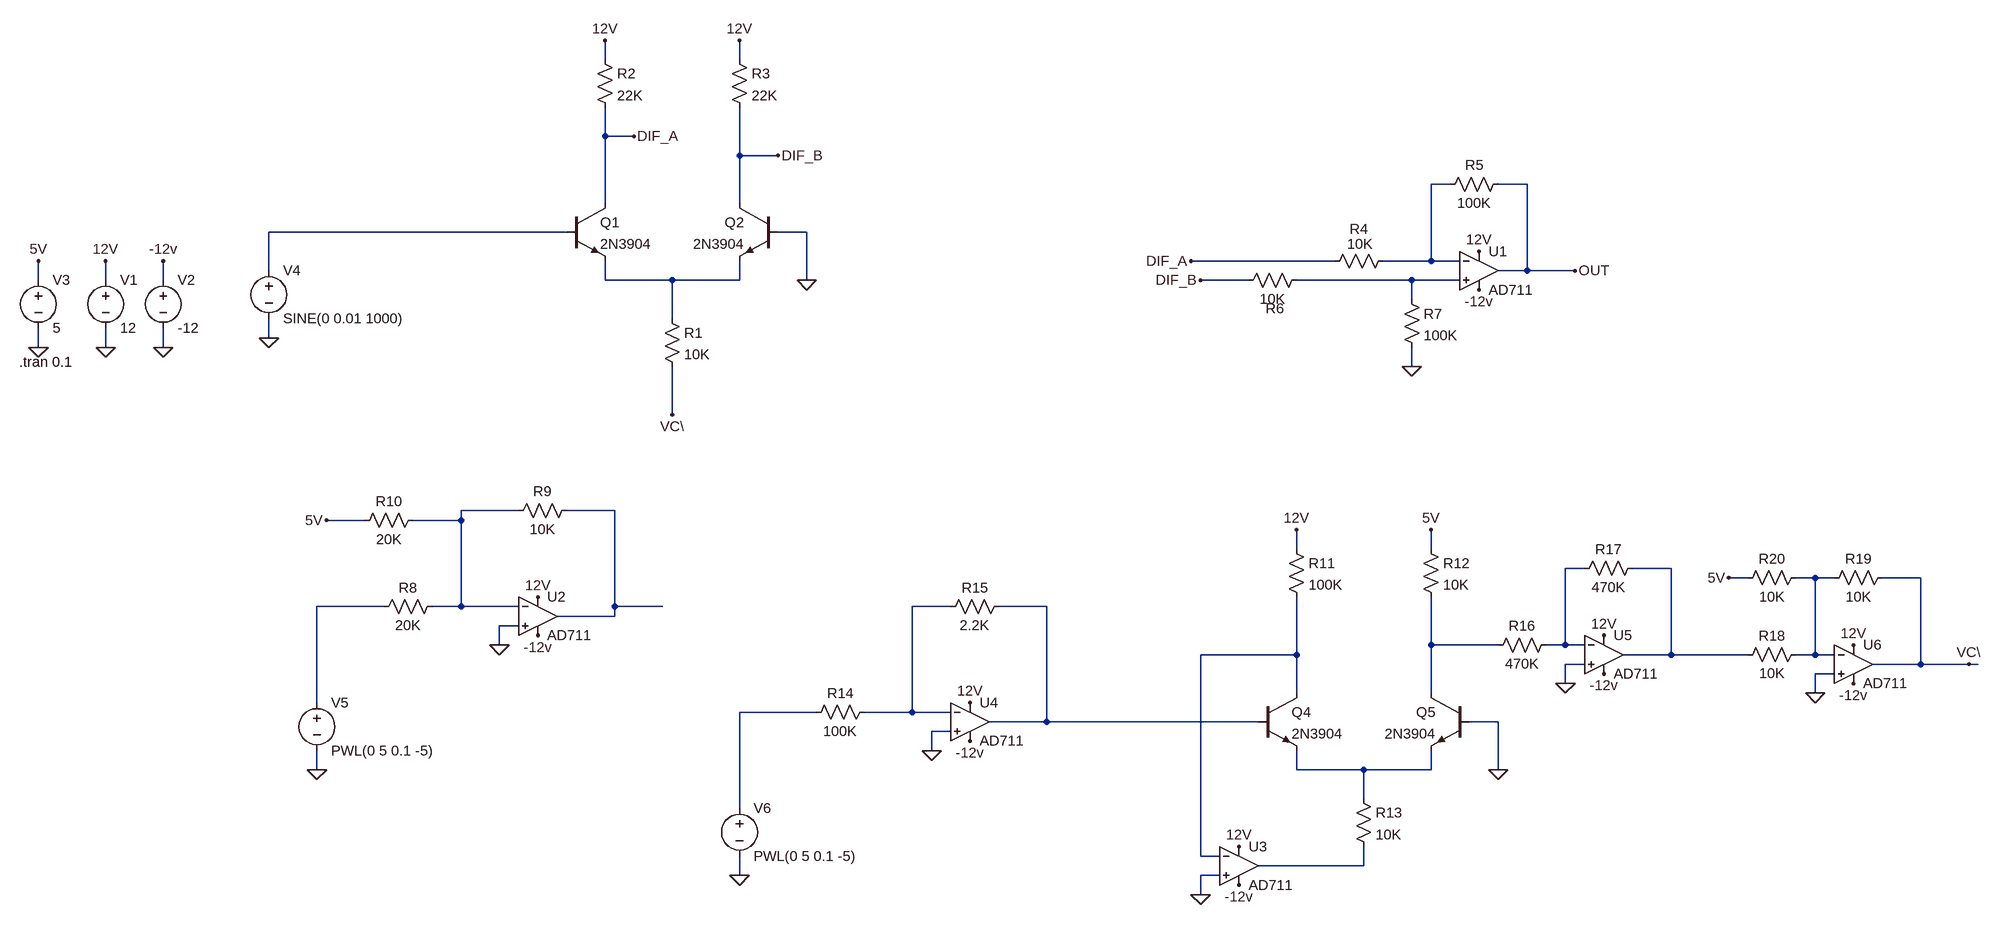
[diagram p0: schematic discrete 404 VCA.asc]
discrete 404 VCA.asc, the LTspice schematic file:
Version 4.1
SHEET 1 3224 1252
WIRE 912 -224 912 -256
WIRE 1136 -224 1136 -256
WIRE 912 -96 912 -144
WIRE 960 -96 912 -96
WIRE 1136 -64 1136 -144
WIRE 1200 -64 1136 -64
WIRE 2320 -16 2288 -16
WIRE 2448 -16 2400 -16
WIRE 912 16 912 -96
WIRE 1136 16 1136 -64
WIRE 848 64 352 64
WIRE 1248 64 1200 64
WIRE 2128 112 1888 112
WIRE 2288 112 2288 -16
WIRE 2288 112 2208 112
WIRE 2336 112 2288 112
WIRE 352 128 352 64
WIRE 2448 128 2448 -16
WIRE 2448 128 2400 128
WIRE 2528 128 2448 128
WIRE -32 144 -32 112
WIRE 80 144 80 112
WIRE 176 144 176 112
WIRE 912 144 912 112
WIRE 1024 144 912 144
WIRE 1136 144 1136 112
WIRE 1136 144 1024 144
WIRE 1248 144 1248 64
WIRE 1984 144 1904 144
WIRE 2256 144 2064 144
WIRE 2336 144 2256 144
WIRE 2256 176 2256 144
WIRE 1024 208 1024 144
WIRE 352 240 352 208
WIRE -32 256 -32 224
WIRE 80 256 80 224
WIRE 176 256 176 224
WIRE 2256 288 2256 256
WIRE 1024 368 1024 288
WIRE 768 528 672 528
WIRE 928 528 848 528
WIRE 512 544 448 544
WIRE 672 544 672 528
WIRE 672 544 592 544
WIRE 2064 592 2064 560
WIRE 2288 592 2288 560
WIRE 2544 624 2512 624
WIRE 2688 624 2624 624
WIRE 2816 640 2784 640
WIRE 2928 640 2896 640
WIRE 2960 640 2928 640
WIRE 3104 640 3040 640
WIRE 544 688 432 688
WIRE 672 688 672 544
WIRE 672 688 624 688
WIRE 768 688 672 688
WIRE 928 688 928 528
WIRE 1008 688 928 688
WIRE 1488 688 1424 688
WIRE 1648 688 1568 688
WIRE 928 704 928 688
WIRE 928 704 832 704
WIRE 768 720 736 720
WIRE 736 752 736 720
WIRE 2288 752 2288 672
WIRE 2400 752 2288 752
WIRE 2512 752 2512 624
WIRE 2512 752 2480 752
WIRE 2544 752 2512 752
WIRE 2064 768 2064 672
WIRE 2064 768 1904 768
WIRE 2688 768 2688 624
WIRE 2688 768 2608 768
WIRE 2816 768 2688 768
WIRE 2928 768 2928 640
WIRE 2928 768 2896 768
WIRE 2960 768 2928 768
WIRE 2544 784 2512 784
WIRE 3104 784 3104 640
WIRE 3104 784 3024 784
WIRE 3184 784 3104 784
WIRE 3200 784 3184 784
WIRE 2960 800 2928 800
WIRE 2512 816 2512 784
WIRE 2064 832 2064 768
WIRE 2288 832 2288 752
WIRE 2928 832 2928 800
WIRE 432 848 432 688
WIRE 1264 864 1136 864
WIRE 1424 864 1424 688
WIRE 1424 864 1344 864
WIRE 1488 864 1424 864
WIRE 1648 880 1648 688
WIRE 1648 880 1552 880
WIRE 2000 880 1648 880
WIRE 2400 880 2352 880
WIRE 1488 896 1456 896
WIRE 1456 928 1456 896
WIRE 432 960 432 928
WIRE 2064 960 2064 928
WIRE 2176 960 2064 960
WIRE 2288 960 2288 928
WIRE 2288 960 2176 960
WIRE 2400 960 2400 880
WIRE 2176 1008 2176 960
WIRE 1136 1024 1136 864
WIRE 1904 1104 1904 768
WIRE 1936 1104 1904 1104
WIRE 2176 1120 2176 1088
WIRE 2176 1120 2000 1120
WIRE 1136 1136 1136 1104
WIRE 1936 1136 1904 1136
WIRE 1904 1168 1904 1136
FLAG 80 256 0
FLAG 80 112 12V
FLAG 176 256 0
FLAG 176 112 -12v
FLAG -32 256 0
FLAG -32 112 5V
FLAG 352 240 0
FLAG 432 960 0
FLAG 1248 144 0
FLAG 912 -256 12V
FLAG 1136 -256 12V
FLAG 2256 288 0
FLAG 2368 160 -12v
FLAG 2368 96 12V
FLAG 960 -96 DIF_A
FLAG 1200 -64 DIF_B
FLAG 1904 144 DIF_B
FLAG 1888 112 DIF_A
FLAG 2528 128 OUT
FLAG 800 736 -12v
FLAG 800 672 12V
FLAG 736 752 0
FLAG 448 544 5V
FLAG 2400 960 0
FLAG 2064 560 12V
FLAG 1968 1152 -12v
FLAG 1968 1088 12V
FLAG 1904 1168 0
FLAG 1520 912 -12v
FLAG 1520 848 12V
FLAG 1456 928 0
FLAG 1136 1136 0
FLAG 2576 800 -12v
FLAG 2576 736 12V
FLAG 2288 560 5V
FLAG 2512 816 0
FLAG 2992 816 -12v
FLAG 2992 752 12V
FLAG 2928 832 0
FLAG 2784 640 5V
FLAG 1024 368 VC\
FLAG 3184 784 VC\
SYMBOL voltage 80 128 R0
WINDOW 123 0 0 Left 0
WINDOW 39 0 0 Left 0
SYMATTR InstName V1
SYMATTR Value 12
SYMBOL voltage 176 128 R0
WINDOW 123 0 0 Left 0
WINDOW 39 0 0 Left 0
SYMATTR InstName V2
SYMATTR Value -12
SYMBOL voltage -32 128 R0
WINDOW 123 0 0 Left 0
WINDOW 39 0 0 Left 0
SYMATTR InstName V3
SYMATTR Value 5
SYMBOL voltage 352 112 R0
WINDOW 123 0 0 Left 0
WINDOW 39 0 0 Left 0
SYMATTR InstName V4
SYMATTR Value SINE(0 0.01 1000)
SYMBOL voltage 432 832 R0
WINDOW 123 0 0 Left 0
WINDOW 39 0 0 Left 0
SYMATTR InstName V5
SYMATTR Value PWL(0 5 0.1 -5)
SYMBOL npn 848 16 R0
SYMATTR InstName Q1
SYMATTR Value 2N3904
SYMBOL npn 1200 16 M0
SYMATTR InstName Q2
SYMATTR Value 2N3904
SYMBOL res 896 -240 R0
SYMATTR InstName R2
SYMATTR Value 22K
SYMBOL res 1120 -240 R0
SYMATTR InstName R3
SYMATTR Value 22K
SYMBOL OpAmps\\AD711 2368 64 R0
SYMATTR InstName U1
SYMBOL res 2224 96 R90
WINDOW 0 -22 56 VBottom 2
WINDOW 3 -28 54 VTop 2
SYMATTR InstName R4
SYMATTR Value 10K
SYMBOL res 2416 -32 R90
WINDOW 0 0 56 VBottom 2
WINDOW 3 32 56 VTop 2
SYMATTR InstName R5
SYMATTR Value 100K
SYMBOL res 2080 128 R90
WINDOW 0 79 52 VBottom 2
WINDOW 3 32 56 VTop 2
SYMATTR InstName R6
SYMATTR Value 10K
SYMBOL res 2240 160 R0
SYMATTR InstName R7
SYMATTR Value 100K
SYMBOL res 1008 192 R0
SYMATTR InstName R1
SYMATTR Value 10K
SYMBOL OpAmps\\AD711 800 640 R0
SYMATTR InstName U2
SYMBOL res 640 672 R90
WINDOW 0 0 56 VBottom 2
WINDOW 3 32 56 VTop 2
SYMATTR InstName R8
SYMATTR Value 20K
SYMBOL res 864 512 R90
WINDOW 0 0 56 VBottom 2
WINDOW 3 32 56 VTop 2
SYMATTR InstName R9
SYMATTR Value 10K
SYMBOL res 608 528 R90
WINDOW 0 0 56 VBottom 2
WINDOW 3 32 56 VTop 2
SYMATTR InstName R10
SYMATTR Value 20K
SYMBOL npn 2000 832 R0
SYMATTR InstName Q4
SYMATTR Value 2N3904
SYMBOL npn 2352 832 M0
SYMATTR InstName Q5
SYMATTR Value 2N3904
SYMBOL res 2048 576 R0
SYMATTR InstName R11
SYMATTR Value 100K
SYMBOL OpAmps\\AD711 1968 1056 R0
SYMATTR InstName U3
SYMBOL res 2160 992 R0
SYMATTR InstName R13
SYMATTR Value 10K
SYMBOL res 2272 576 R0
SYMATTR InstName R12
SYMATTR Value 10K
SYMBOL OpAmps\\AD711 1520 816 R0
SYMATTR InstName U4
SYMBOL voltage 1136 1008 R0
WINDOW 123 0 0 Left 0
WINDOW 39 0 0 Left 0
SYMATTR InstName V6
SYMATTR Value PWL(0 5 0.1 -5)
SYMBOL res 1360 848 R90
WINDOW 0 0 56 VBottom 2
WINDOW 3 32 56 VTop 2
SYMATTR InstName R14
SYMATTR Value 100K
SYMBOL res 1584 672 R90
WINDOW 0 0 56 VBottom 2
WINDOW 3 32 56 VTop 2
SYMATTR InstName R15
SYMATTR Value 2.2K
SYMBOL OpAmps\\AD711 2576 704 R0
SYMATTR InstName U5
SYMBOL res 2496 736 R90
WINDOW 0 0 56 VBottom 2
WINDOW 3 32 56 VTop 2
SYMATTR InstName R16
SYMATTR Value 470K
SYMBOL res 2640 608 R90
WINDOW 0 0 56 VBottom 2
WINDOW 3 32 56 VTop 2
SYMATTR InstName R17
SYMATTR Value 470K
SYMBOL OpAmps\\AD711 2992 720 R0
SYMATTR InstName U6
SYMBOL res 2912 752 R90
WINDOW 0 0 56 VBottom 2
WINDOW 3 32 56 VTop 2
SYMATTR InstName R18
SYMATTR Value 10K
SYMBOL res 3056 624 R90
WINDOW 0 0 56 VBottom 2
WINDOW 3 32 56 VTop 2
SYMATTR InstName R19
SYMATTR Value 10K
SYMBOL res 2912 624 R90
WINDOW 0 0 56 VBottom 2
WINDOW 3 32 56 VTop 2
SYMATTR InstName R20
SYMATTR Value 10K
TEXT -64 280 Left 2 !.tran 0.1

The netlist it stands for:
* discrete 404 VCA.asc
V1 12V 0 12
V2 -12v 0 -12
V3 5V 0 5
V4 N002 0 SINE(0 0.01 1000)
V5 N010 0 PWL(0 5 0.1 -5)
Q1 DIF_A N002 N003 0 2N3904
Q2 DIF_B 0 N003 0 2N3904
R2 12V DIF_A 22K
R3 12V DIF_B 22K
X§U1 N004 N001 12V -12v OUT AD712  ; AD711, pins In+ In- V+ V- OUT
R4 N001 DIF_A 10K
R5 OUT N001 100K
R6 N004 DIF_B 10K
R7 N004 0 100K
R1 N003 VC\ 10K
X§U2 0 N005 12V -12v N006 AD712  ; AD711, pins In+ In- V+ V- OUT
R8 N005 N010 20K
R9 N006 N005 10K
R10 N005 5V 20K
Q4 N014 N012 N016 0 2N3904
Q5 N013 0 N016 0 2N3904
R11 12V N014 100K
X§U3 0 N014 12V -12v N017 AD712  ; AD711, pins In+ In- V+ V- OUT
R13 N016 N017 10K
R12 5V N013 10K
X§U4 0 N011 12V -12v N012 AD712  ; AD711, pins In+ In- V+ V- OUT
V6 N015 0 PWL(0 5 0.1 -5)
R14 N011 N015 100K
R15 N012 N011 2.2K
X§U5 0 N007 12V -12v N008 AD712  ; AD711, pins In+ In- V+ V- OUT
R16 N007 N013 470K
R17 N008 N007 470K
X§U6 0 N009 12V -12v VC\ AD712  ; AD711, pins In+ In- V+ V- OUT
R18 N009 N008 10K
R19 VC\ N009 10K
R20 N009 5V 10K
.model NPN NPN
.model PNP PNP
.lib standard.bjt
.tran 0.1
.lib ADI1.lib
.backanno
.end